# Altium schematic sheet pidp11-io-expander.SchDoc: Top Sheet
size Letter; SheetNumber: 1; SheetTotal: 1
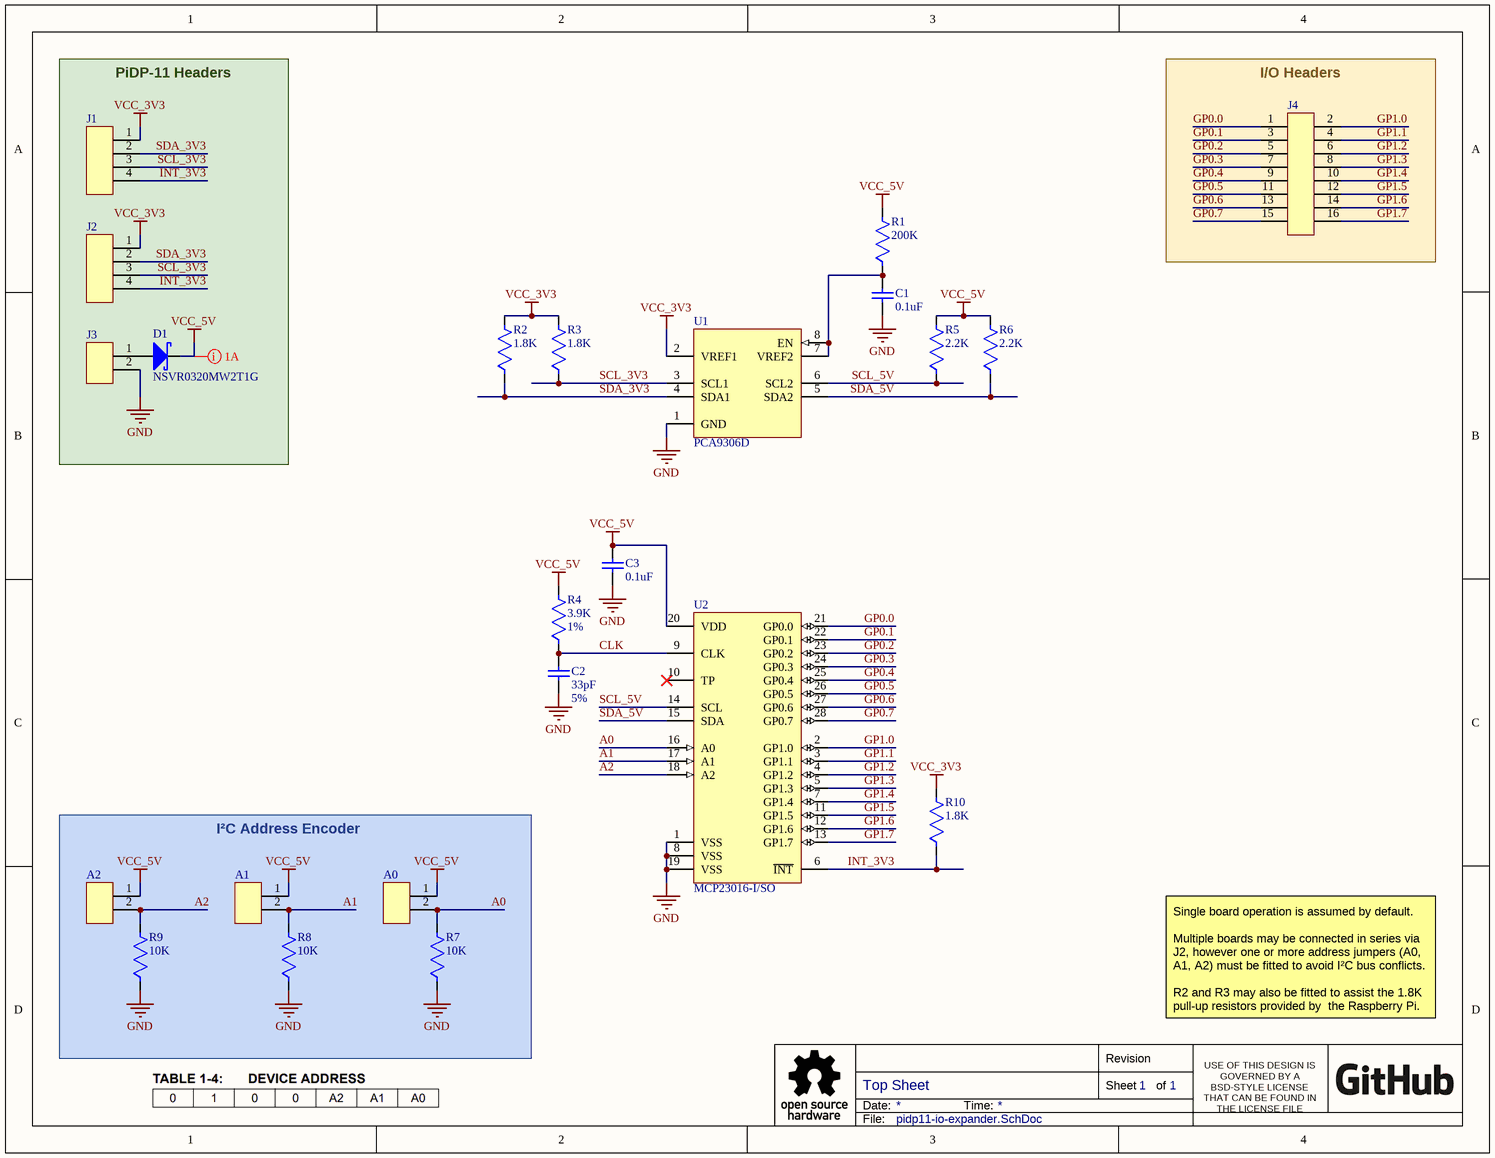
[diagram p0: pidp11-io-expander.SchDoc]

## Parts
A0  10129378-902001BLF  [AMPH-10129378-902001BLF]  (value not drawn)
A1  10129378-902001BLF  [AMPH-10129378-902001BLF]  (value not drawn)
A2  10129378-902001BLF  [AMPH-10129378-902001BLF]  (value not drawn)
C1  0.1uF  [AVX-CC0402]
C2  33pF  Tolerance: 5%  [AVX-CC0402]
C3  0.1uF  [AVX-CC0402]
D1  NSVR0320MW2T1G  [ONSC-NSVR0320MW2T1G]
J1  10129378-904001BLF  [AMPH-10129378-904001BLF]  (value not drawn)
J2  10129378-904001BLF  [AMPH-10129378-904001BLF]  (value not drawn)
J3  10129378-902001BLF  [AMPH-10129378-902001BLF]  (value not drawn)
J4  10129381-916001BLF  [AMPH-10129381-916001BLF]  (value not drawn)
R1  200K  [VBEY-CR0402]
R2  1.8K  [VBEY-CR0402]
R3  1.8K  [VBEY-CR0402]
R4  3.9K  Tolerance: 1%  [VBEY-CR0402]
R5  2.2K  [VBEY-CR0402]
R6  2.2K  [VBEY-CR0402]
R7  10K  [VBEY-CR0402]
R8  10K  [VBEY-CR0402]
R9  10K  [VBEY-CR0402]
R10  1.8K  [VBEY-CR0402]
U1  PCA9306D  [NXP-PCA9306D]
U2  MCP23016-I/SO  [MCHP-SOIC-28]

## Blocks framed on the sheet
PiDP-11 Headers: D1 J1-J3
I/O Headers: J4
I²C Address Encoder: A0-A2 R7-R9

## Nets
GND: C1.1 C2.2 C3.1 J3.2 R7.1 R8.1 R9.1 U1.1(GND) U2.1(VSS) U2.8(VSS) U2.19(VSS)
VCC_3V3: J1.1 J2.1 R2.2 R3.2 R10.2 U1.2(VREF1)
VCC_5V: A0.1 A1.1 A2.1 C3.2 D1.C R1.2 R4.2 R5.2 R6.2 U2.20(VDD)
A0: A0.2 R7.2 U2.16(A0)
A1: A1.2 R8.2 U2.17(A1)
A2: A2.2 R9.2 U2.18(A2)
CLK: C2.1 R4.1 U2.9(CLK)
GP0.0: J4.1 U2.21(GP0.0)
GP0.1: J4.3 U2.22(GP0.1)
GP0.2: J4.5 U2.23(GP0.2)
GP0.3: J4.7 U2.24(GP0.3)
GP0.4: J4.9 U2.25(GP0.4)
GP0.5: J4.11 U2.26(GP0.5)
GP0.6: J4.13 U2.27(GP0.6)
GP0.7: J4.15 U2.28(GP0.7)
GP1.0: J4.2 U2.2(GP1.0)
GP1.1: J4.4 U2.3(GP1.1)
GP1.2: J4.6 U2.4(GP1.2)
GP1.3: J4.8 U2.5(GP1.3)
GP1.4: J4.10 U2.7(GP1.4)
GP1.5: J4.12 U2.11(GP1.5)
GP1.6: J4.14 U2.12(GP1.6)
GP1.7: J4.16 U2.13(GP1.7)
INT_3V3: J1.4 J2.4 R10.1 U2.6(~{INT})
SCL_3V3: J1.3 J2.3 R3.1 U1.3(SCL1)
SCL_5V: R5.1 U1.6(SCL2) U2.14(SCL)
SDA_3V3: J1.2 J2.2 R2.1 U1.4(SDA1)
SDA_5V: R6.1 U1.5(SDA2) U2.15(SDA)
NetC1_2: C1.2 R1.1 U1.7(VREF2) U1.8(EN)
NetD1_A: D1.A J3.1

Not connected (* = marked no-connect by the designer): U2 10(TP)*

## Layout directives
net class 1A: VCC_5V

## Notes on the sheet
- Single board operation is assumed by default.
  Multiple boards may be connected in series via J2, however one or more address jumpers (A0, A1, A2) must be fitted to avoid I²C bus conflicts.
  R2 and R3 may also be fitted to assist the 1.8K pull-up resistors provided by  the Raspberry Pi.
- Date:
- Time:
- Revision
- Sheet
- of
- USE OF THIS DESIGN IS GOVERNED BY A BSD-STYLE LICENSE THAT CAN BE FOUND IN THE LICENSE FILE
- File:

## Library data of the parts
A0-A2 J3 = 10129378-902001BLF: CONN HEADER VERT 2POS 2.54MM; Manufacturer: Amphenol ICC; Number of Positions: 2; Manufacturer Part Number: 10129378-902001BLF; Supplier 1: Digi-Key; Supplier 2: Mouser; Supplier Part Number 1: 10129378-902001BLF-ND; Supplier Part Number 2: 649-1012937890201BLF; ComponentLink1Description: Datasheet; ComponentLink1URL: https://cdn.amphenol-icc.com/media/wysiwyg/files/drawing/10129378.pdf; ComponentLink2Description: Manufacturer URL; ComponentLink2URL: https://www.amphenol-icc.com/product-series/econostik-254mm.html; Number of Rows: 1; Pitch: 2.54mm
C1 C3 = 04023C104KAT2A: CAP CER 0.1UF 25V X7R 0402; Manufacturer: AVX; Tolerance: 10%; Manufacturer Part Number: 04023C104KAT2A; Supplier 1: Digi-Key; Supplier 2: Mouser; Supplier Part Number 1: 478-7868-1-ND; Supplier Part Number 2: 581-04023C104KAT2A; ComponentLink1Description: Datasheet; ComponentLink1URL: https://catalogs.avx.com/SurfaceMount.pdf; ComponentLink2Description: Manufacturer URL; ComponentLink2URL: https://www.avx.com/products/ceramic-capacitors/surface-mount/x7r-dielectric/; Case Code: 0402; Value: 0.1uF; Voltage Rating: 25V
C2 = 04023A330JAT2A: CAP CER 33PF 25V C0G/NP0 0402; Manufacturer: AVX; Manufacturer Part Number: 04023A330JAT2A; ComponentLink1Description: Datasheet; ComponentLink1URL: https://catalogs.avx.com/SurfaceMount.pdf; Supplier 1: Digi-Key; Supplier 2: Mouser; Supplier Part Number 1: 478-12613-1-ND; Supplier Part Number 2: 581-04023A330JAT2A; ComponentLink2Description: Manufacturer URL; ComponentLink2URL: https://www.avx.com/products/ceramic-capacitors/surface-mount/c0g-np0-dielectric/; Case Code: 0402; Value: 33pF; Voltage Rating: 25V
D1 = NSVR0320MW2T1G: DIODE SCHOTTKY 20V 1A SOD323; Manufacturer: ON Semiconductor; Forward Voltage: 500mV; Reverse Leakage: 1mA; Forward Current: 1A; Manufacturer Part Number: NSVR0320MW2T1G; Case Code: SOD-323; Reverse Voltage: 20V; Supplier 1: Digi-Key; Supplier Part Number 1: NSVR0320MW2T1GOSCT-ND; Supplier 2: Mouser; Supplier Part Number 2: 863-NSVR0320MW2T1G; ComponentLink1Description: Datasheet; ComponentLink1URL: https://www.onsemi.com/pdf/datasheet/nsr0320mw2t1-d.pdf; ComponentLink2Description: Manufacturer URL; ComponentLink2URL: https://www.onsemi.com/products/discretes-drivers/diodes-rectifiers/schottky-diodes-schottky-rectifiers/nsr0320
J1 J2 = 10129378-904001BLF: CONN HEADER VERT 4POS 2.54MM; Manufacturer: Amphenol ICC; Number of Positions: 4; Manufacturer Part Number: 10129378-904001BLF; ComponentLink1Description: Datasheet; ComponentLink1URL: https://cdn.amphenol-icc.com/media/wysiwyg/files/drawing/10129378.pdf; Supplier 1: Digi-Key; Supplier 2: Mouser; Supplier Part Number 1: 10129378-904001BLF-ND; Supplier Part Number 2: 649-1012937890401BLF; ComponentLink2Description: Manufacturer URL; ComponentLink2URL: https://www.amphenol-icc.com/product-series/econostik-254mm.html; Number of Rows: 1; Pitch: 2.54mm
J4 = 10129381-916001BLF: CONN HEADER VERT 16POS 2.54MM; Manufacturer: Amphenol ICC; Number of Positions: 8; Manufacturer Part Number: 10129381-916001BLF; Pitch: 2.54mm; Number of Rows: 2; ComponentLink1Description: Manufacturer URL; ComponentLink1URL: https://www.amphenol-icc.com/product-series/econostik-254mm.html; ComponentLink2Description: Datasheet; ComponentLink2URL: https://cdn.amphenol-icc.com/media/wysiwyg/files/drawing/10129381.pdf; Supplier 1: Digi-Key; Supplier Part Number 1: 10129381-916001BLF-ND; Supplier 2: Mouser; Supplier Part Number 2: 649-1012938191601BLF
R1 = MCS04020C2003FE000: RES SMD 200K OHM 1% 1/10W 0402; Manufacturer: Vishay Beyschlag; Supplier 1: Digi-Key; Supplier 2: Mouser; Supplier Part Number 1: 749-1562-1-ND; Supplier Part Number 2: 594-MCS04020C2003FE0; ComponentLink1Description: Datasheet; ComponentLink1URL: https://www.vishay.com/docs/28705/mcx0x0xpro.pdf; Manufacturer Part Number: MCS04020C2003FE000; ComponentLink2Description: Manufacturer URL; ComponentLink2URL: https://www.vishay.com/product?docid=28705; Power: 1/10W; Case Code: 0402; Tolerance: 1%; Value: 200K
R2 R3 R10 = MCS04020C1801FE000: RES SMD 1.8K OHM 1% 1/10W 0402; Manufacturer: Vishay Beyschlag; ComponentLink1Description: Datasheet; ComponentLink1URL: https://www.vishay.com/docs/28705/mcx0x0xpro.pdf; Manufacturer Part Number: MCS04020C1801FE000; ComponentLink2Description: Manufacturer URL; ComponentLink2URL: https://www.vishay.com/product?docid=28705; Supplier 1: Digi-Key; Supplier 2: Mouser; Supplier Part Number 1: 749-1558-1-ND; Supplier Part Number 2: 594-MCS04020C1801FE0; Case Code: 0402; Power: 1/10W; Tolerance: 1%; Value: 1.8K
R4 = MCS04020C3901FE000: RES SMD 3.9K OHM 1% 1/10W 0402; Manufacturer: Vishay Beyschlag; ComponentLink1Description: Datasheet; ComponentLink1URL: https://www.vishay.com/docs/28705/mcx0x0xpro.pdf; Manufacturer Part Number: MCS04020C3901FE000; ComponentLink2Description: Manufacturer URL; ComponentLink2URL: https://www.vishay.com/product?docid=28705; Supplier 1: Digi-Key; Supplier 2: Mouser; Supplier Part Number 1: 749-1578-1-ND; Supplier Part Number 2: 594-MCS04020C3901FE0; Power: 1/10W; Case Code: 0402; Value: 3.9K
R5 R6 = MCS04020C2201FE000: RES SMD 2.2K OHM 1% 1/10W 0402; Manufacturer: Vishay Beyschlag; ComponentLink1Description: Datasheet; ComponentLink1URL: https://www.vishay.com/docs/28705/mcx0x0xpro.pdf; Manufacturer Part Number: MCS04020C2201FE000; ComponentLink2Description: Manufacturer URL; ComponentLink2URL: https://www.vishay.com/product?docid=28705; Supplier 1: Digi-Key; Supplier 2: Mouser; Supplier Part Number 1: 749-1564-1-ND; Supplier Part Number 2: 594-MCS04020C2201FE0; Power: 1/10W; Case Code: 0402; Tolerance: 1%; Value: 2.2K
R7-R9 = MCS0402MC1002FE000: RES SMD 10K OHM 1% 1/10W 0402; Manufacturer: Vishay Beyschlag; ComponentLink1Description: Datasheet; ComponentLink1URL: https://www.vishay.com/docs/28705/mcx0x0xpro.pdf; Manufacturer Part Number: MCS0402MC1002FE000; ComponentLink2Description: Manufacturer URL; ComponentLink2URL: https://www.vishay.com/product?docid=28705; Supplier 1: Digi-Key; Supplier 2: Mouser; Supplier Part Number 2: 594-MCS0402MC1002FE0; Supplier Part Number 1: MCS0402-10.0K-MFCT-ND; Case Code: 0402; Power: 1/10W; Tolerance: 1%; Value: 10K
U1 = PCA9306D: IC TRNSLTR BIDIRECTIONAL 8SO; Manufacturer: NXP; Manufacturer Part Number: PCA9306D; Supplier 1: Digi-Key; Supplier 2: Mouser; Supplier Part Number 1: 568-4214-1-ND; Supplier Part Number 2: 771-PCA9306DP-T; ComponentLink1Description: Datasheet; ComponentLink1URL: https://www.nxp.com/docs/en/data-sheet/PCA9306.pdf; ComponentLink2Description: Manufacturer URL; ComponentLink2URL: https://www.nxp.com/products/interfaces/ic-spi-serial-interface-devices/ic-voltage-level-translators/dual-bidirectional-i2c-bus-and-smbus-voltage-level-translator:PCA9306; Case Code: SO-8
U2 = MCP23016-I/SO: IC I/O EXPANDER I2C 16B 28SOIC; Manufacturer: Microchip; Manufacturer Part Number: MCP23016-I/SO; ComponentLink1Description: Datasheet; ComponentLink1URL: https://ww1.microchip.com/downloads/en/DeviceDoc/20090C.pdf; ComponentLink2Description: Manufacturer URL; ComponentLink2URL: https://www.microchip.com/wwwproducts/en/MCP23016; Supplier 1: Digi-Key; Supplier 2: Mouser; Supplier Part Number 1: MCP23016-I/SO-ND; Supplier Part Number 2: 579-MCP23016-I/SO; Case Code: SOIC-28